# EAGLE design trigger (EAGLE 9.6.2)
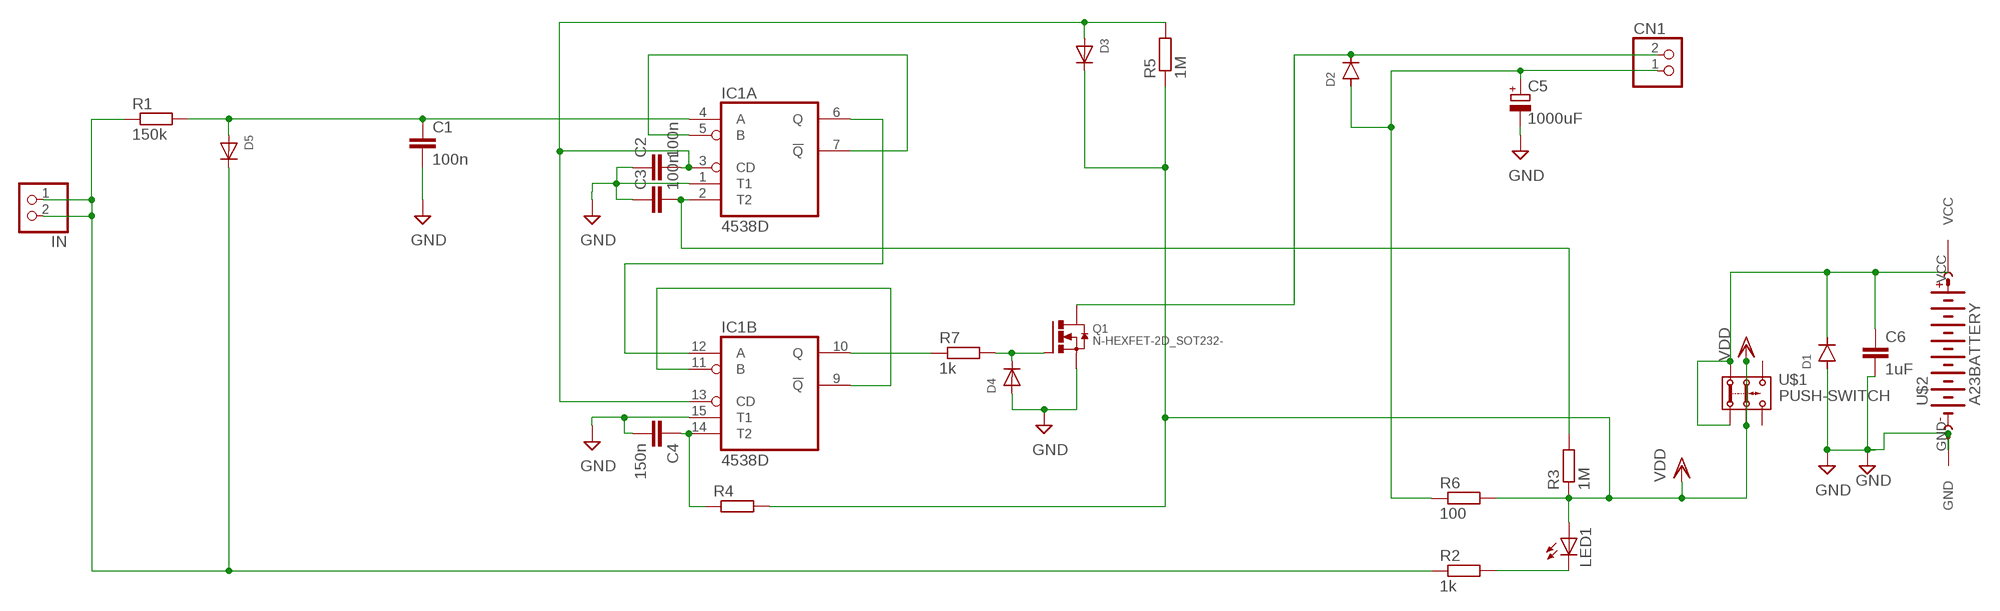
[diagram p0: schematic, sheet 1]

## Parts
C1  100n  C  [C0805]
C2  100n  C  [C0805]
C3  100n  C  [C0805]
C4  150n  C  [C0805]
C5  1000uF  CPOL-EUE5-6  [E5-6]
C6  1uF  CC1808  [C1808]
CN1  JST_2PIN-THM  [JST-PH-2-THM]
D1  D-SMB  [SMB]
D2  D-SMB  [SMB]
D3  DIODESOD-123  [SOD-123]
D4  DIODESOD-123  [SOD-123]
D5  DIODESOD-123  [SOD-123]
IC1  4538D  [SO16]
IN  JST_2PIN-THM  [JST-PH-2-THM]
LED1  LED3MM  [LED3MM]
Q1  N-HEXFET-2D_SOT232-  [SOT223]
R1  150k  RR1206  [R1206]
R2  1k  RR1206  [R1206]
R3  1M  RR1206  [R1206]
R4  RR1206  [R1206]
R5  1M  RR1206  [R1206]
R6  100  RR2512  [R2512]
R7  1k  RR1206  [R1206]
U$1  PUSH-SWITCH  [PUSH-SWITCH]
U$2  A23BATTERY  [A23]

## Nets
GND: C1.2 C2.1 C3.1 C4.2 C5.- C6.2 D1.2(A) D4.A IC1.1(A:T1) IC1.15(B:T1) Q1.3(S) U$2.GND
N$1: C6.1 D1.1(C) U$1.P$1(1.2) U$1.P$5(1.1) U$2.VCC
N$2: IC1.9(B:!Q) IC1.11(B:B)
N$3: IC1.5(A:B) IC1.7(A:!Q)
N$4: IC1.6(A:Q) IC1.12(B:A)
N$5: D5.C IN.1 IN.2 R1.1 R2.1
N$6: C1.1 D5.A IC1.4(A:A) R1.2
N$7: LED1.K(C) R2.2
N$8: C4.1 IC1.14(B:T2) R4.1
N$9: C3.2 IC1.2(A:T2) R3.2
N$10: C2.2 D3.A IC1.3(A:CD) IC1.13(B:CD) R5.2
N$11: IC1.10(B:Q) R7.1
N$12: D4.C Q1.1(G) R7.2
N$13: CN1.2 D2.1(C) Q1.2(D) Q1.4(D)
N$14: C5.+ CN1.1 D2.2(A) R6.1
VDD: D3.C LED1.A R3.1 R4.2 R5.1 R6.2 U$1.P$2(2.2) U$1.P$6(2.1)
Unconnected: U$1.P$3(3.2) U$1.P$4(3.1)

## Power pins joined to a net without a drawn wire
GND: IC1.8(P:VSS)
VDD: IC1.16(P:VDD)

## Library data of the parts
C1-C4 C6 = eagle-ltspice:C: CAPACITOR, European symbol; SPICEMODEL: NONE; SPICEPREFIX: C
C5 = rcl:CPOL-EU: POLARIZED CAPACITOR, European symbol; SPICEPREFIX: C
CN1 IN = adafruit:JST_2PIN: JST 2-Pin Connectors of various flavors SMT-RA (S2B-PH-SM4) 4UConnector #17311 SMT (B2B-PH-SM4) THM-RA (S2B-PH) THM (B2B-PH)
D1 D2 = semicon-smd-ipc:D-: DIODE unfilled
D3-D5 = adafruit:DIODE: Diode SMADIODE - SMA Surface Mount Package 20V 1A Schottky Diode Digikey: 641-1014-6-ND DO-1N4148 - Through Hole Small Current Diode SOD-123 20V 1 A (.5mV Vf) Schottky Diode - Digikey: MBRX120TPMSCT-ND SOD-323 10V 570mA (.38mV Vf, 3ns) Schottky Diode - Digikey: ZLLS410CT-ND SOD-523 30V 30mA Schottky Diode (RB751S-40TE61) - Digikey: RB751S-40TE61CT-ND SOT23-R/W - SOT23 Package (R = Solder Paste/Reflow Ovens, W = Hand-Soldering) BAT54Film 40V 300mA - Digikey: 497-7162-1-ND
IC1 = 45xx:4538: Dual precision monostable MULTIVIBRATOR
LED1 = adafruit:LED: LED OSRAM: - CHIPLED LG R971, LG N971, LY N971, LG Q971, LY Q971, LO R971, LY R971 LH N974, LH R974 LS Q976, LO Q976, LY Q976 LO Q996 - Hyper CHIPLED LW Q18S LB Q993, LB Q99A, LB R99A - SideLED LS A670, LO A670, LY A670, LG A670, LP A670 LB A673, LV A673, LT A673, LW A673 LH A674 LY A675 LS A676, LA A676, LO A676, LY A676, LW A676 LS A679, LY A679, LG A679 - Hyper Micro SIDELED® LS Y876, LA Y876, LO Y876, LY Y876 LT Y87S - SmartLED LW L88C, LW L88S LB L89C, LB L89S, LG L890 LS L89K, LO L89K, LY L89K LS L896, LA L896, LO L896, LY L896 - TOPLED LS T670, LO T670, LY T670, LG T670, LP T670 LSG T670, LSP T670, LSY T670, LOP T670, LYG T670 LG T671, LOG T671, LSG T671 LB T673, LV T673, LT T673, LW T673 LH T674 LS T676, LA T676, LO T676, LY T676, LB T676, LH T676, LSB T676, LW T676 LB T67C, LV T67C, LT T67C, LS T67K, LO T67K, LY T67K, LW E67C LS E67B, LA E67B, LO E67B, LY E67B, LB E67C, LV E67C, LT E67C LW T67C LS T679, LY T679, LG T679 LS T770, LO T770, LY T770, LG T770, LP T770 LB T773, LV T773, LT T773, LW T773 LH T774 LS E675, LA E675, LY E675, LS T675 LS T776, LA T776, LO T776, LY T776, LB T776 LHGB T686 LT T68C, LB T68C - Hyper Mini TOPLED® LB M676 - Mini TOPLED Santana® LG M470 LS M47K, LO M47K, LY M47K Source: http://www.osram.convergy.de/
Q1 = transistor-power:N-HEXFET-2D_?-*: HEXFET® Power MOSFET 2 Drain connects http://www.irf.com/product-info/datasheets/data/irll014n.pdf
R1-R7 = eagle-ltspice:R: RESISTOR, European symbol; SPICEMODEL: NONE; SPICEPREFIX: R
U$1 = zort-library:PUSH-SWITCH
U$2 = zort-library:A23BATTERY

## Board
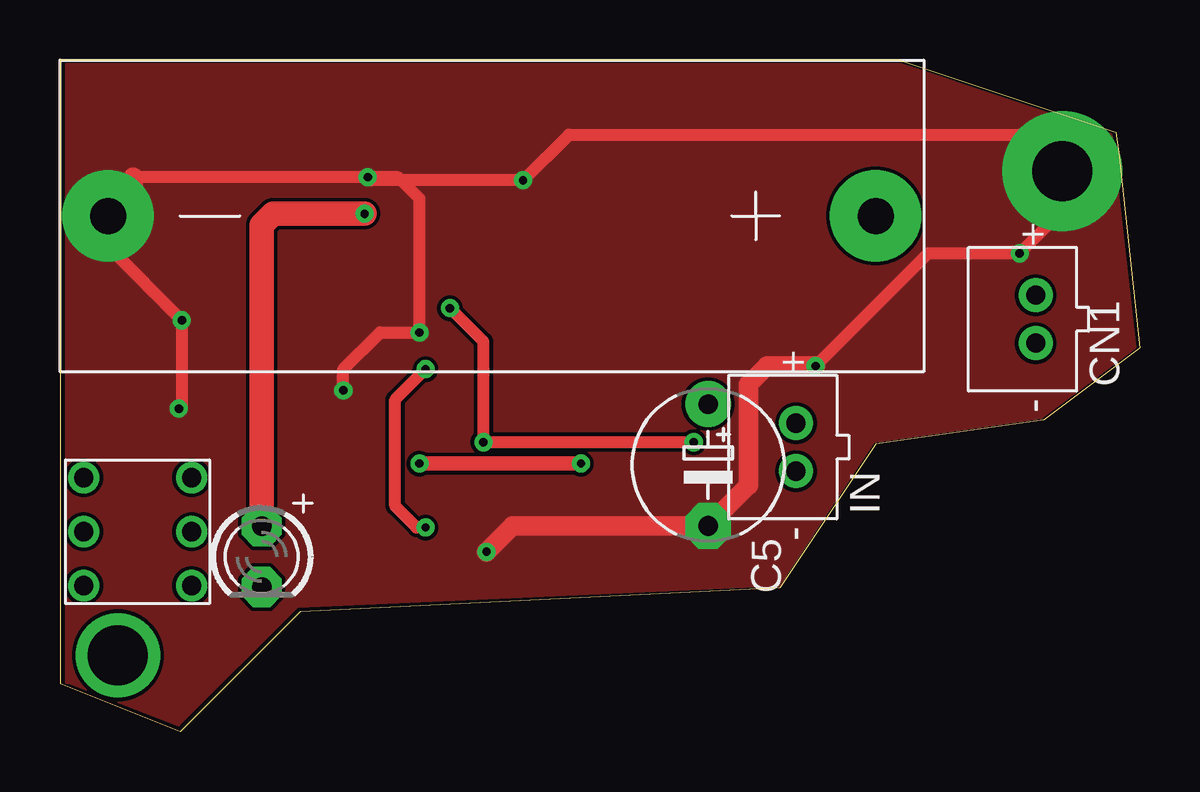
[diagram p1: board, top side]
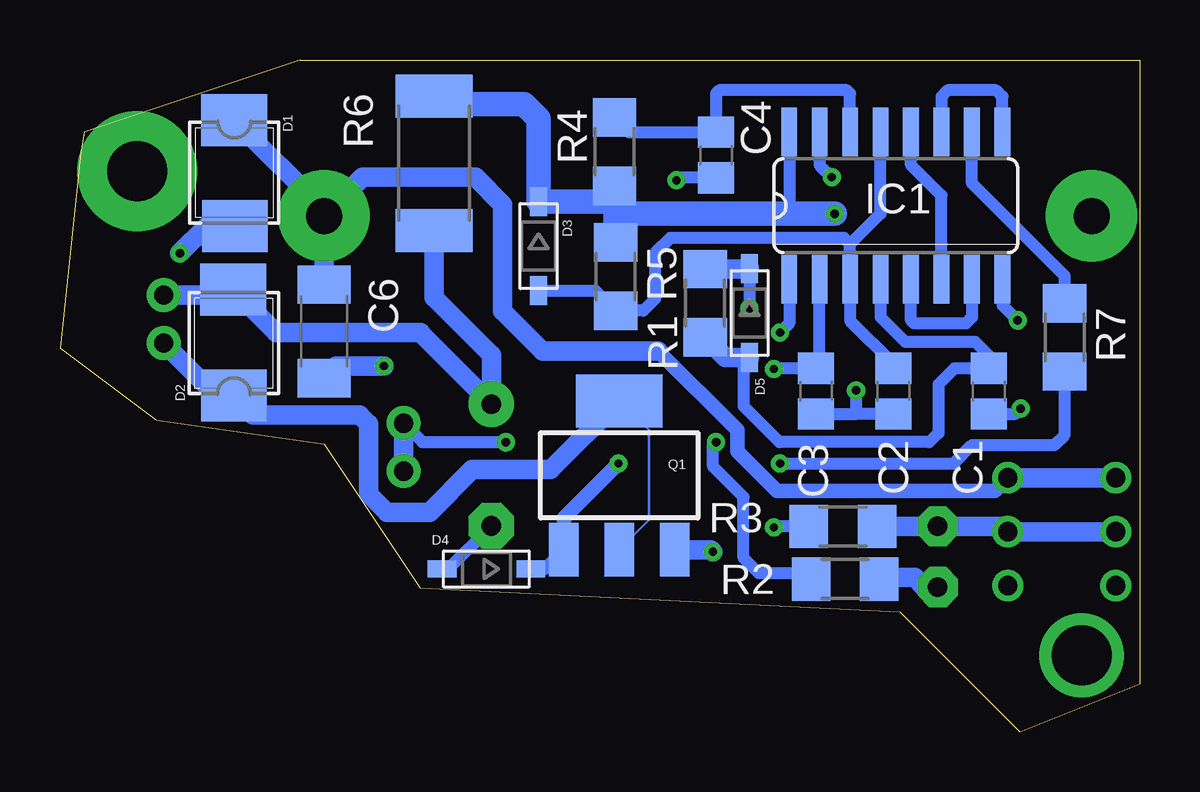
[diagram p2: board, bottom side, seen from below]

Size 45 x 28 mm. Coordinates in mm from the lower left corner, seen from the top.
Outline: 35,28 0,28 0,2 5,0 10,5 30,6 34,12 41,13 45,16 44.13,24.13 44,25 35,28
Copper layers (1*16): Top 0.035mm / dielectric 1.5mm / Bottom 0.035mm
Design rules "default *": minimum track width 6mil, minimum drill 0.35mm, track to track 6mil, track to pad 6mil, pad to pad 6mil, via to via 6mil, smd to smd 6mil, copper to edge 0mil, drill to drill 6mil, minimum pad ring 10mil, minimum via ring 8mil, stop-mask expansion 4mil, vias tented up to drill 0mil, thermal gap 10mil

### Footprints (pad centres in the part's own frame; a part is rotated, then mirrored left to right if it is on the bottom)
C0805 = smd 1.3 x 1.5: 1 -0.95,0; 2 0.95,0
E5-6 = drill 0.813 pad 1.905: + -2.54,0 | drill 0.813 pad 1.905 octagon: - 2.54,0
C1808 = smd 1.6 x 2.2: 1 -1.95,0; 2 1.95,0
JST-PH-2-THM = drill 0.8 pad 1.422: 1 1,0; 2 -1,0
SMB = smd 2.159 x 2.743: 1 -2.311,-0.127; 2 2.108,-0.102
SOD-123 = smd 1.2 x 0.7: A 1.85,0; C -1.85,0
SO16 = smd 0.66 x 2.032: 1 -4.445,-3.073; 2 -3.175,-3.073; 3 -1.905,-3.073; 4 -0.635,-3.073; 5 0.635,-3.073; 6 1.905,-3.073; 7 3.175,-3.073; 8 4.445,-3.073; 9 4.445,3.073; 10 3.175,3.073; 11 1.905,3.073; 12 0.635,3.073; 13 -0.635,3.073; 14 -1.905,3.073; 15 -3.175,3.073; 16 -4.445,3.073
LED3MM = drill 0.813 pad 1.676 octagon: A -1.27,0; K 1.27,0
SOT223 = smd 1.219 x 2.235: 1 -2.311,-3.099; 2 0,-3.099; 3 2.311,-3.099 | smd 3.6 x 2.2: 4 0,3.099
R1206 = smd 1.6 x 1.803: 1 -1.422,0; 2 1.422,0
R2512 = smd 1.8 x 3.2: 1 -2.8,0; 2 2.8,0
PUSH-SWITCH = drill 0.8: P$1 0.75,0.75; P$2 3,0.75; P$3 5.25,0.75; P$4 5.25,5.25; P$5 0.75,5.25; P$6 3,5.25
A23 = drill 1.5 pad 3.81: GND 2,6.5; VCC 34,6.5

### Placement (x,y rotation side)
C1  6.28,14.19 270 bottom
C2  10.26,14.19 90 bottom
C3  13.48,14.19 90 bottom
C4  17.65,24.04 270 bottom
C5  27.02,11.11 270 top
C6  33.99,16.68 270 bottom
CN1  40.67,17.19 90 top
D1  37.61,23.18 270 bottom
D2  37.88,16.32 90 bottom
D3  25.05,20.24 270 bottom
D4  27.23,6.78 180 bottom
D5  16.26,17.45 270 bottom
IC1  10.16,21.92 0 bottom
IN  30.68,11.86 90 top
LED1  8.41,7.29 270 top
Q1  21.68,10.68 0 bottom
R1  18.11,17.86 270 bottom
R2  12.27,6.36 0 bottom
R3  12.37,8.55 180 bottom
R4  21.88,24.18 270 bottom
R5  21.84,18.97 270 bottom
R6  29.41,23.68 90 bottom
R7  3.12,16.43 270 bottom
U$1  0.24,11.33 270 top
U$2  0,15 0 top

### Tracks (layer width: path | path; a pad name or v marks a point on that pad's centre or on a via)
GND  (via drill 0.35, 2.5 pad 5)
  Top 0.508: 2,20.23 v5.08,17.14 5.08,13.59 v4.95,13.46 | v11.81,14.22 11.81,15.11 13.34,16.64 v14.99,16.64 14.99,22.23 14.1,23.11 v12.83,23.11 | v12.83,23.11 3.05,23.11 2,22.07 | v12.83,23.11 12.95,22.99 v19.3,22.99 21.21,24.89 40.26,24.89 v41.78,23.37 41.91,23.24 41.91,21.84 v40.01,19.94 36.2,19.94 v31.5,15.24
  Top 0.813: v31.5,15.24 29.46,15.24 28.7,14.48 28.7,10.26 C5.- 18.86,8.57 v17.78,7.49 | 2,20.23 U$2.GND 3.05,22.55 3.05,23.11
  Bottom 0.508: IC1.8 5.71,17.78 v5.08,17.14 | C3.1 11.81,13.24 | C2.1 11.81,13.24 | 11.81,13.24 v11.81,14.22 | IC1.15 13.33,23.62 v12.83,23.11 | C4.2 19.21,23.09 v19.3,22.99 | C1.2 5.17,13.24 v4.95,13.46 | IC1.1 14.6,17.02 v14.99,16.64 | D4.A 28.81,6.78 C5.-
  Bottom 0.813: v17.78,7.49 17.87,7.58 Q1.3 | v40.01,19.94 38.87,21.07 D1.2 | v31.5,15.24 33.48,15.24 C6.2
  pour Top (isolate 0.152, no thermals): 0.25,27.81 35.05,27.81 43.81,24.89 44.83,16 40.89,13.08 33.91,12.06 29.97,6.1 9.91,5.21 4.95,0.25 0.38,2.03 0.25,2.03
N$1
  Bottom 0.61: U$1.P$5 6.04,10.03 15.11,10.03 16.76,11.68 16.76,12.57 20.07,15.88
  Bottom 0.813: U$1.P$1 U$1.P$5 | U$2.VCC 34,21.75 D1.1 | C6.1 33.99,21.49 U$2.VCC | U$2.VCC 32.39,23.11 27.69,23.11 26.54,21.97 26.54,17.53 24.89,15.88 20.07,15.88
N$2
  Bottom 0.508: IC1.9 5.71,26.48 5.97,26.73 8,26.73 8.25,26.48 IC1.11
N$3
  Bottom 0.508: IC1.7 6.98,17.27 7.24,17.02 9.4,17.02 9.53,17.14 IC1.5
N$4
  Bottom 0.508: IC1.6 8.25,22.35 9.52,23.62 IC1.12
N$5  (via drill 0.35)
  Top 0.508: v16.26,17.65 17.65,16.26 v17.65,12.06 v26.42,12.06
  Bottom 0.508: D5.C v16.26,17.66 v16.26,17.65 | R2.1 13.94,6.6 15.88,6.6 16.51,7.24 16.51,9.78 17.78,11.05 17.78,11.94 v17.65,12.06 | IN.1 29.89,12.06 v26.42,12.06
  Bottom 0.813: R1.1 16.27,19.28 D5.C | IN.2 IN.1
N$6
  Bottom 0.508: IC1.4 10.79,17.27 9.78,16.26 6.86,16.26 6.28,15.68 C1.1 7.72,15.14 8.38,14.48 8.38,12.45 8.76,12.06 15.01,12.06 16.51,13.57 16.51,15.35 D5.A
  Bottom 0.813: R1.2 17.27,15.6 D5.A
N$7
  Bottom 0.813: R2.2 10.72,6.46 9.96,6.42 9.37,6.42 8.97,6.02 LED1.K
N$8
  Bottom 0.508: R4.1 21.27,24.98 C4.1 17.65,26.61 17.53,26.73 12.19,26.73 12.06,26.6 IC1.14
N$9  (via drill 0.35)
  Top 0.508: v15.24,8.51 14.86,8.51 13.97,9.4 13.97,13.84 v15.24,15.11
  Bottom 0.508: IC1.2 13.33,15.29 C3.2 15.21,15.14 v15.24,15.11 | R3.2 15.2,8.55 v15.24,8.51
N$10
  Bottom 0.508: C2.2 10.26,15.34 12.06,17.14 IC1.3 12.06,20.32 | IC1.13 10.79,21.59 12.06,20.32 | D3.A 22.68,18.39 R5.2 20.68,17.55 20.19,18.03 20.19,19.94 19.56,20.57 12.32,20.57 12.06,20.32
N$11
  Bottom 0.508: R7.1 3.12,19 6.98,22.86 IC1.10
N$12  (via drill 0.35)
  Top 0.61: v14.99,11.18 v21.72,11.18
  Bottom 0.508: D4.C 24.8,6.78 Q1.1 | v14.99,11.18 7.75,11.18 6.99,11.94 3.56,11.94 3.12,12.37 R7.2
  Bottom 0.61: Q1.1 24,8.9 v21.72,11.18
N$13
  Bottom 0.102: Q1.2 20.45,8.82 20.45,12.57 21.65,13.78 Q1.4
  Bottom 0.813: CN1.2 38.57,14.09 37.99,14.01 D2.1 36.95,13.21 32.51,13.21 32.13,12.83 32.13,9.91 31.37,9.14 29.59,9.14 27.81,10.92 24.54,10.92 Q1.4
N$14
  Bottom 0.813: CN1.1 38.01,18.19 D2.2 35.98,16.64 29.97,16.64 29.97,16.61 C5.+ 27.02,15.7 29.41,18.09 R6.1
N$16  (via drill 2.5)
  other vias: 2.41,3.17
VDD  (via drill 0.35)
  Top 1.016: LED1.A 8.41,21.11 8.89,21.59 v12.7,21.59
  Bottom 0.508: 21.84,22.71 R4.2 | IC1.16 14.6,21.59
  Bottom 0.813: U$1.P$2 U$1.P$6 5.71,8.56 LED1.A R3.1
  Bottom 1.016: R6.2 29.08,26.16 25.65,26.16 25.05,25.56 D3.C 22.45,22.09 21.84,22.71 21.84,21.59 | R5.1 21.84,21.59 | 21.84,21.59 14.6,21.59 v12.7,21.59